# Altium project SUBBOARD-MCU.PrjPcb
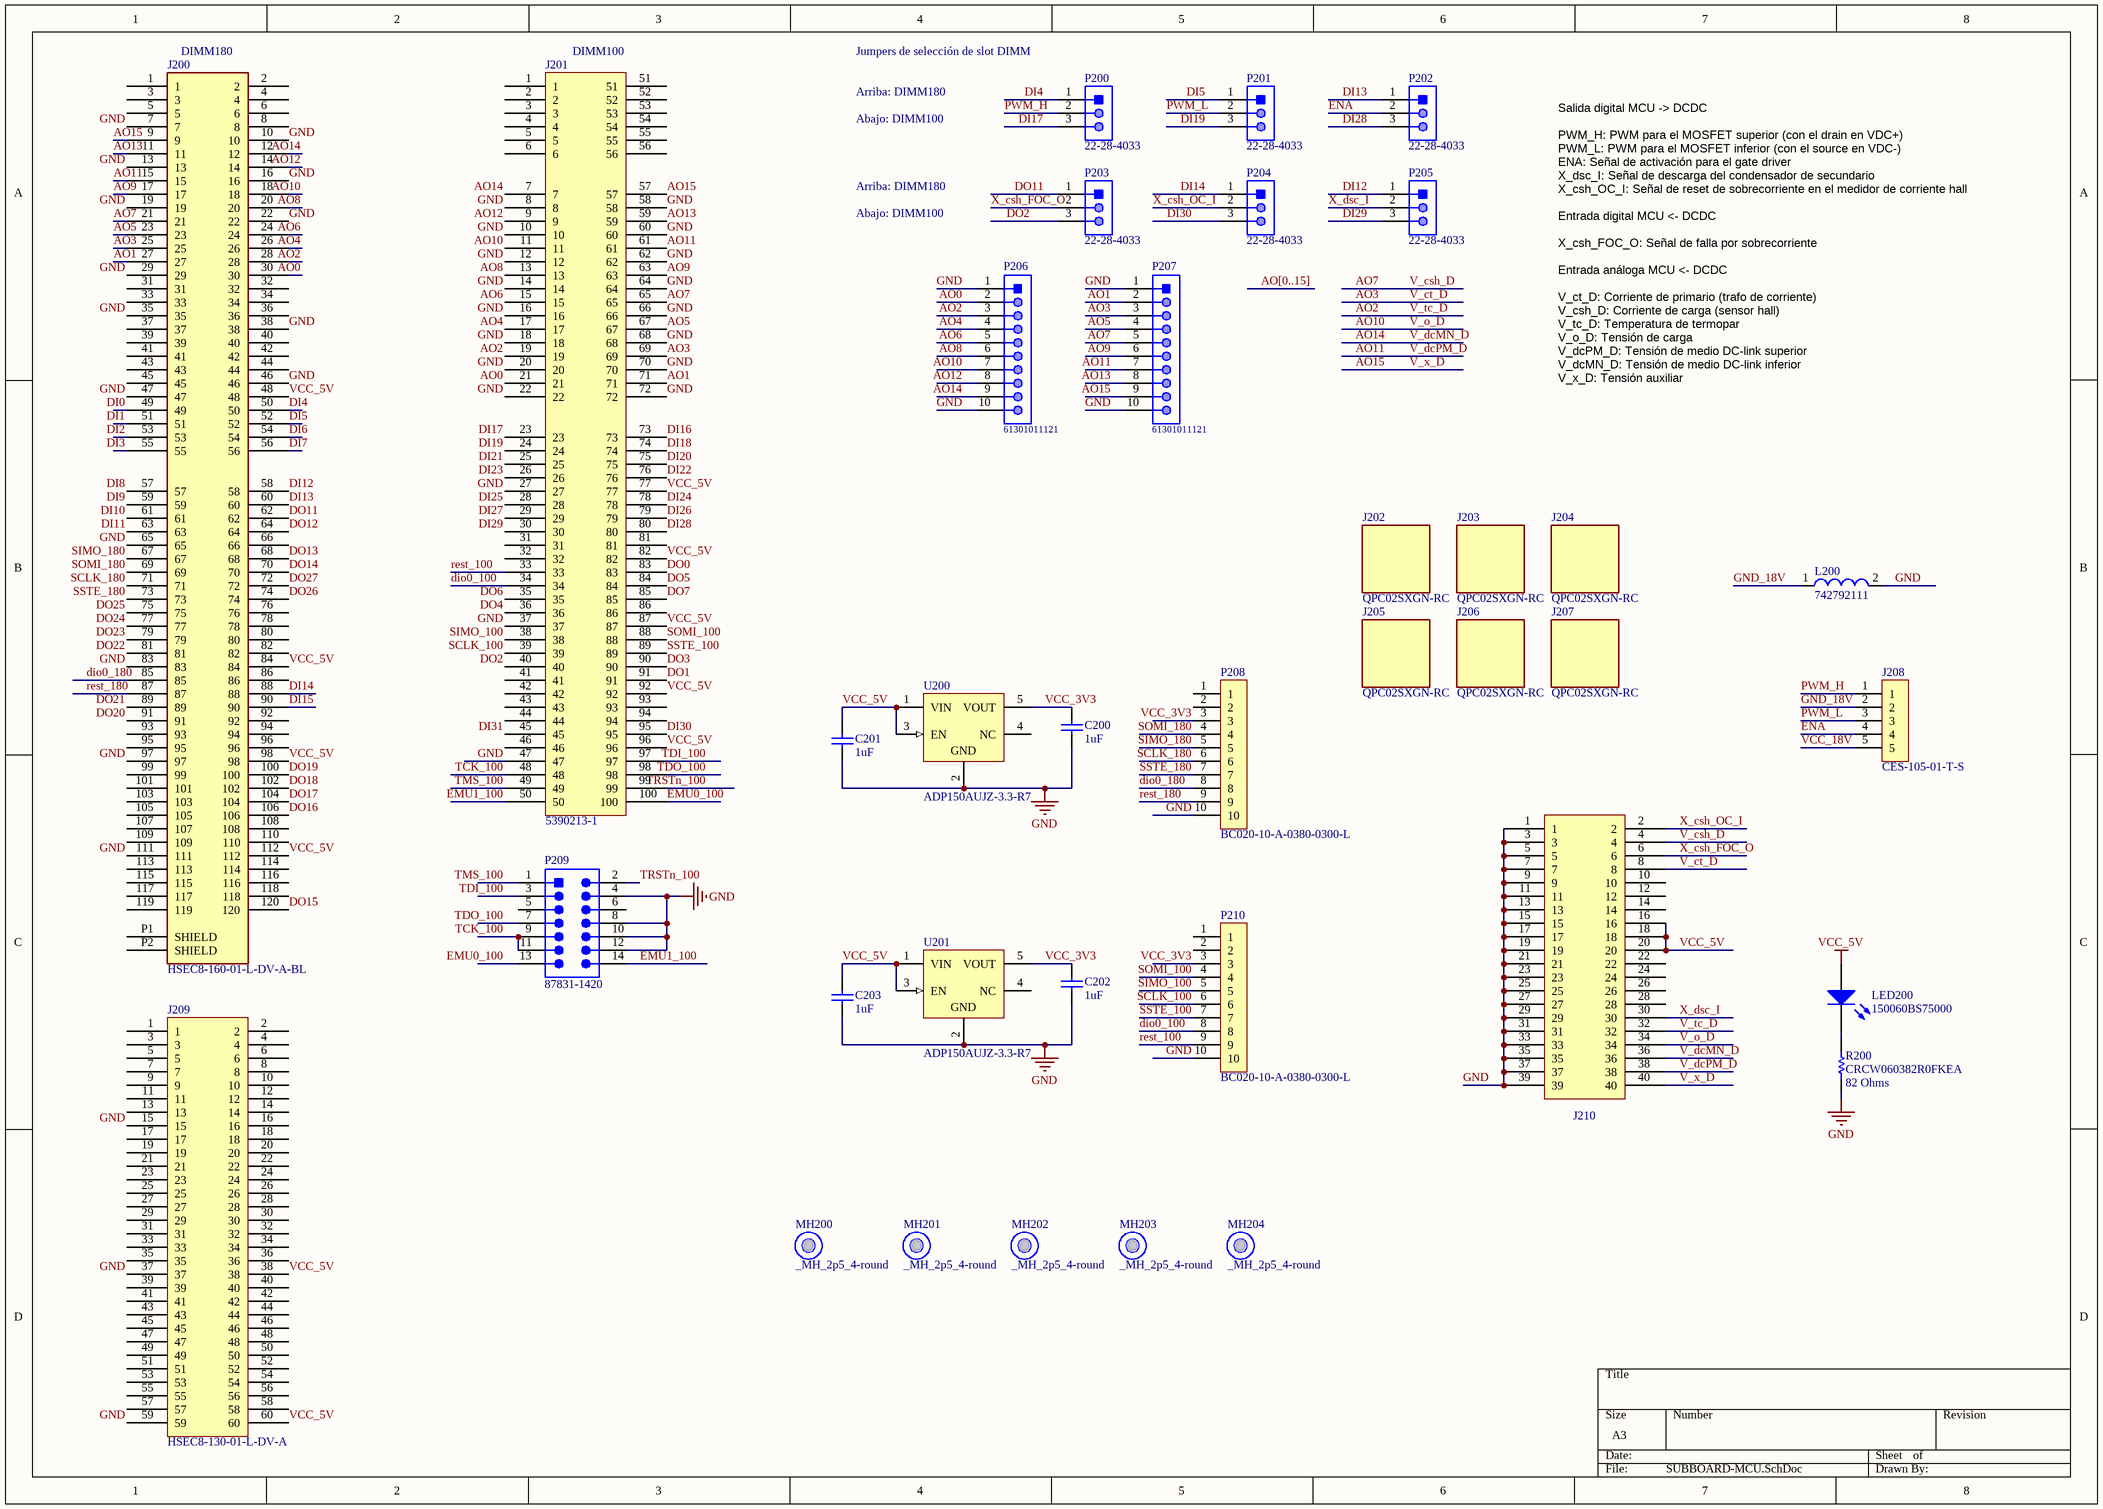
[diagram p0: SUBBOARD-MCU.SchDoc]
1 sheet, 36 parts. Net scope: global (net labels, ports and power ports of the same name join across sheets).
Board file: SUBBOARD-MCU.PcbDoc

## Sheet SUBBOARD-MCU.SchDoc
size A3

### Parts
C200  value 1uF  [CAPC0603(1608)100_N]  (hidden comment: CAP 1uF 50V 0603(1608))
C201  value 1uF  [CAPC0603(1608)100_N]  (hidden comment: CAP 1uF 50V 0603(1608))
C202  value 1uF  [CAPC0603(1608)100_N]  (hidden comment: CAP 1uF 50V 0603(1608))
C203  value 1uF  [CAPC0603(1608)100_N]  (hidden comment: CAP 1uF 50V 0603(1608))
J200  HSEC8-160-01-L-DV-A-BL  [HSEC8-160-01-L-DV-A-BL]
J201  5390213-1  [TE_5390213-1]
J202  QPC02SXGN-RC  [FP-QPC02SXGN-RC-MFG]
J203  QPC02SXGN-RC  [FP-QPC02SXGN-RC-MFG]
J204  QPC02SXGN-RC  [FP-QPC02SXGN-RC-MFG]
J205  QPC02SXGN-RC  [FP-QPC02SXGN-RC-MFG]
J206  QPC02SXGN-RC  [FP-QPC02SXGN-RC-MFG]
J207  QPC02SXGN-RC  [FP-QPC02SXGN-RC-MFG]
J208  CES-105-01-T-S  [CES-105-01-T-S]
J209  HSEC8-130-01-L-DV-A  [HSEC8-130-01-L-DV-A]
J210  CLP-120-02-F-DH  [CLP-120-02-F-DH]  (value not drawn)
L200  742792111  [SMD-1206]
LED200  150060BS75000  [0603_A]
MH200  _MH_2p5_4-round  [_MH_2p5_4-round]
MH201  _MH_2p5_4-round  [_MH_2p5_4-round]
MH202  _MH_2p5_4-round  [_MH_2p5_4-round]
MH203  _MH_2p5_4-round  [_MH_2p5_4-round]
MH204  _MH_2p5_4-round  [_MH_2p5_4-round]
P200  22-28-4033  [MOLX-22-28-4033_V]
P201  22-28-4033  [MOLX-22-28-4033_V]
P202  22-28-4033  [MOLX-22-28-4033_V]
P203  22-28-4033  [MOLX-22-28-4033_V]
P204  22-28-4033  [MOLX-22-28-4033_V]
P205  22-28-4033  [MOLX-22-28-4033_V]
P206  61301011121  [61301011121]
P207  61301011121  [61301011121]
P208  BC020-10-A-0380-0300-L  [BC020-10-A-0380-0300-L]
P209  87831-1420  [MOLEX-87831-1420_V]
P210  BC020-10-A-0380-0300-L  [BC020-10-A-0380-0300-L]
R200  CRCW060382R0FKEA  value 82 Ohms  [RESC1609X50X30LL10T20]
U200  ADP150AUJZ-3.3-R7  [ADI-UJ-5_M]
U201  ADP150AUJZ-3.3-R7  [ADI-UJ-5_M]

### Nets
GND: C200.1 C201.1 C202.1 C203.1 J200.7 J200.10 J200.13 J200.16 J200.19 J200.22 J200.29 J200.35 J200.38 J200.46 J200.47 J200.65 J200.83 J200.97 J200.111 J201.8 J201.10 J201.12 J201.14 J201.16 J201.18 J201.20 J201.22 J201.27 J201.37 J201.47 J201.58 J201.60 J201.62 J201.64 J201.66 J201.68 J201.70 J201.72 J209.15 J209.37 J209.59 J210.1 J210.3 J210.5 J210.7 J210.9 J210.11 J210.13 J210.15 J210.17 J210.19 J210.21 J210.23 J210.25 J210.27 J210.29 J210.31 J210.33 J210.35 J210.37 J210.39 L200.2 P206.1 P206.10 P207.1 P207.10 P208.10 P209.4 P209.8 P209.10 P209.12 P210.10 R200.2 U200.2(GND) U201.2(GND)
VCC_5V: C201.2 C203.2 J200.48 J200.84 J200.98 J200.112 J201.77 J201.82 J201.87 J201.92 J201.96 J209.38 J209.60 J210.16 J210.18 J210.20 LED200.2(A) U200.1(VIN) U200.3(EN) U201.1(VIN) U201.3(EN)
AO0: J200.30 J201.21 P206.2
AO1: J200.27 J201.71 P207.2
AO2: J200.28 J201.19 J210.32 P206.3  [also labelled V_tc_D]
AO3: J200.25 J201.69 J210.8 P207.3  [also labelled V_ct_D]
AO4: J200.26 J201.17 P206.4
AO5: J200.23 J201.67 P207.4
AO6: J200.24 J201.15 P206.5
AO7: J200.21 J201.65 J210.4 P207.5  [also labelled V_csh_D]
AO8: J200.20 J201.13 P206.6
AO9: J200.17 J201.63 P207.6
AO10: J200.18 J201.11 J210.34 P206.7  [also labelled V_o_D]
AO11: J200.15 J201.61 J210.38 P207.7  [also labelled V_dcPM_D]
AO12: J200.14 J201.9 P206.8
AO13: J200.11 J201.59 P207.8
AO14: J200.12 J201.7 J210.36 P206.9  [also labelled V_dcMN_D]
AO15: J200.9 J201.57 J210.40 P207.9  [also labelled V_x_D]
DI0: J200.49
DI1: J200.51
DI2: J200.53
DI3: J200.55
DI4: J200.50 P200.1
DI5: J200.52 P201.1
DI6: J200.54
DI7: J200.56
DI8: J200.57
DI9: J200.59
DI10: J200.61
DI11: J200.63
DI12: J200.58 P205.1
DI13: J200.60 P202.1
DI14: J200.88 P204.1
DI15: J200.90
DI16: J201.73
DI17: J201.23 P200.3
DI18: J201.74
DI19: J201.24 P201.3
DI20: J201.75
DI21: J201.25
DI22: J201.76
DI23: J201.26
DI24: J201.78
DI25: J201.28
DI26: J201.79
DI27: J201.29
DI28: J201.80 P202.3
DI29: J201.30 P205.3
DI30: J201.95 P204.3
DI31: J201.45
dio0_100: J201.34 P210.8
dio0_180: J200.85 P208.8
DO0: J201.83
DO1: J201.91
DO2: J201.40 P203.3
DO3: J201.90
DO4: J201.36
DO5: J201.84
DO6: J201.35
DO7: J201.85
DO11: J200.62 P203.1
DO12: J200.64
DO13: J200.68
DO14: J200.70
DO15: J200.120
DO16: J200.106
DO17: J200.104
DO18: J200.102
DO19: J200.100
DO20: J200.91
DO21: J200.89
DO22: J200.81
DO23: J200.79
DO24: J200.77
DO25: J200.75
DO26: J200.74
DO27: J200.72
EMU0_100: J201.100 P209.13
EMU1_100: J201.50 P209.14
ENA: J208.4 P202.2
GND_18V: J208.2 L200.1
PWM_H: J208.1 P200.2
PWM_L: J208.3 P201.2
rest_100: J201.33 P210.9
rest_180: J200.87 P208.9
SCLK_100: J201.39 P210.6
SCLK_180: J200.71 P208.6
SIMO_100: J201.38 P210.5
SIMO_180: J200.67 P208.5
SOMI_100: J201.88 P210.4
SOMI_180: J200.69 P208.4
SSTE_100: J201.89 P210.7
SSTE_180: J200.73 P208.7
TCK_100: J201.48 P209.9 P209.11
TDI_100: J201.97 P209.3
TDO_100: J201.98 P209.7
TMS_100: J201.49 P209.1
TRSTn_100: J201.99 P209.2
VCC_3V3: C200.2 C202.2 P208.3 P210.3 U200.5(VOUT) U201.5(VOUT)
VCC_18V: J208.5
X_csh_FOC_O: J210.6 P203.2
X_csh_OC_I: J210.2 P204.2
X_dsc_I: J210.30 P205.2
NetLED200_1: LED200.1(K) R200.1

Not connected (* = marked no-connect by the designer): J200 1 2 3 4 5 6 8 31 32 33 34 36 37 39 40 41 42 43 44 45 66 76 78 80 82 86 92 93 94 95 96 99 101 103 105 107 108 109 110 113 114 115 116 117 118 119 P1(SHIELD) P2(SHIELD); J201 1 2 3 4 5 6 31 32 41 42 43 44 46 51 52 53 54 55 56 81 86 93 94; J209 1 2 3 4 5 6 7 8 9 10 11 12 13 14 16 17 18 19 20 21 22 23 24 25 26 27 28 29 30 31 32 33 34 35 36 39 40 41 42 43 44 45 46 47 48 49 50 51 52 53 54 55 56 57 58; J210 10 12 14 22 24 26 28; P208 1 2; P209 5 6; P210 1 2; U200 4(NC); U201 4(NC)

### Buses and harness runs
bus AO[0..15]

### Notes on the sheet
- (near J200) DIMM180
- (near J201) DIMM100
- Arriba: DIMM180
- (near P200) Jumpers de selección de slot DIMM
- Abajo: DIMM100
- Salida digital MCU -> DCDC
  PWM_H: PWM para el MOSFET superior (con el drain en VDC+)
  PWM_L: PWM para el MOSFET inferior (con el source en VDC-)
  ENA: Señal de activación para el gate driver
  X_dsc_I: Señal de descarga del condensador de secundario
  X_csh_OC_I: Señal de reset de sobrecorriente en el medidor de corriente hall
  Entrada digital MCU <- DCDC
  X_csh_FOC_O: Señal de falla por sobrecorriente
  Entrada análoga MCU <- DCDC
  V_ct_D: Corriente de primario (trafo de corriente)
  V_csh_D: Corriente de carga (sensor hall)
  V_tc_D: Temperatura de termopar
  V_o_D: Tensión de carga
  V_dcPM_D: Tensión de medio DC-link superior
  V_dcMN_D: Tensión de medio DC-link inferior
  V_x_D: Tensión auxiliar

### Library data of the parts
C200-C203 = CMP-1035-02746-1: CAP 1uF 50V ±20% 0603 (1608 Metric) Thickness 1mm SMD; Tolerance: Â±20%; Case-EIA: 0603; Case-Metric: 1608; Technology: SMT; Max Thickness: 1 mm; Rated Voltage: 50 V
J200 = HSEC8-160-01-L-DV-A-BL: Standard Card Edge Connectors 0.80 mm Edge Rate High-Speed Edge Card Connector, Vertical; Manufacturer: Samtec; Number of Contacts: 120; Pitch: 0.8mm; Manufacturer Part Number: HSEC8-160-01-L-DV-A-BL; RoHS: Yes; Category: Card Edge Connectors; Stock 1: 1044; Pricing 1: 1=8,23000, 10=7,88900, 25=7,20320, 50=6,86000, 100=6,51700, 250=5,83100, 500=5,48800, 1000=4,80200, 2500=4,56190 (USD); Mount: Surface Mount; Contact Plating: Gold; Number of Rows: 2; Packaging: Bulk; Termination: Solder; Radiation Hardening: No; ComponentLink1URL: http://www.farnell.com/datasheets/2260788.pdf?src-supplier=Farnell; ComponentLink1Description: http://www.farnell.com/datasheets/2260788.pdf?src-supplier=Farnell; ComponentLink2URL: http://www.farnell.com/datasheets/2581211.pdf?src-supplier=Farnell; ComponentLink2Description: http://www.farnell.com/datasheets/2581211.pdf?src-supplier=Farnell; ComponentLink3URL: http://suddendocs.samtec.com/catalog_english/hsec8_dv.pdf?src-supplier=Digi-Key; ComponentLink3Description: http://suddendocs.samtec.com/catalog_english/hsec8_dv.pdf?src-supplier=Digi-Key; ComponentLink4URL: http://www.samtec.com/ftppub/pdf/HSEC8_DV.pdf?src-supplier=Avnet; ComponentLink4Description: http://www.samtec.com/ftppub/pdf/HSEC8_DV.pdf?src-supplier=Avnet; ComponentLink5URL: http://www.farnell.com/datasheets/2581211.pdf?src-supplier=Element14; ComponentLink5Description: http://www.farnell.com/datasheets/2581211.pdf?src-supplier=Element14; ComponentLink6URL: http://www.farnell.com/datasheets/2581211.pdf?src-supplier=Newark; ComponentLink6Description: http://www.farnell.com/datasheets/2581211.pdf?src-supplier=Newark; Supplier 1: Digi-Key; Supplier 2: Arrow; Supplier 3: Mouser; Supplier Part Number 1: SAM9083-ND; Supplier Part Number 2: HSEC8-160-01-L-DV-A-BL; Supplier Part Number 3: 200-HSEC816001LDVABL
J201 = 5390213-1: 100 Position DIMM DRAM Socket Through Hole; Centerline_Pitch: 1.27 mm[.05 in]; MF: TE Connectivity; Number_of_Positions: 100; SnapEDA_Link: https://www.snapeda.com/parts/5390213-1/TE%20Connectivity%20AMP%20Connectors/view-part/781316/?ref=snap; MP: 5390213-1; TE_purchase_URL: https://www.te.com/usa-en/product-5390213-1.html?te_bu=Cor&te_type=disp&te_campaign=seda_glo_cor-seda-global-disp-prtnr-fy19-seda-model-bom-cta_sma-317_1&elqCampaignId=32493; Availability: Unavailable; EU_RoHS_Compliance: Compliant; Price: None; Product_Type: Socket; Package: None; Value: *; Supplier 1: Newark; Supplier 2: Digi-Key; Supplier 3: Mouser; Supplier Part Number 1: 42K7163; Supplier Part Number 2: A121375-ND; Supplier Part Number 3: 571-5390213-1
J202-J207 = CMP-25666-000001-1: CONN JUMPER SHORTING .100" GOLD; Manufacturer: Sullins; Conn Orientation: Straight; Pitch: 2.54mm; Current Rating: 3A; Number Of Contacts: 2; Category: Conn; Temperature Range Low: -40°C; Temperature Range High: +85°C; Device Class L1: Connectors; Lead Free: Yes; Manufacturer Part Number: QPC02SXGN-RC; Automotive: No; Height: 6.17mm; ComponentLink2URL: https://s3.amazonaws.com/catalogspreads-pdf/PAGE128-129%20.100%20JUMPER.pdf; Device Class L2: unset; Footprint Url: https://drawings-pdf.s3.amazonaws.com/11510.pdf; Device Class L3: unset; Temperature: -40°C to +85°C; RoHS: TRUE; Digikey Description: CONN JUMPER SHORTING .100" GOLD; Octopart: https://octopart.com/qpc02sxgn-rc-sullins-19878795; Package: 0; ComponentLink2Description: Datasheet; Contact Material: Gold
J208 = CES-105-01-T-S: SAMTEC         CES-105-01-T-S             Board-To-Board Connector, CES Series, 5 Contacts, Receptacle, 2.54 mm, Through Hole, 1 Rows; Number of Contacts: 5; Contact Resistance: 10mR; Max Current Rating: 1A; Max Voltage Rating (AC): 400V; Pitch: 2.54mm; Manufacturer: Samtec; Manufacturer Part Number: CES-105-01-T-S; RoHS: Yes; Category: Connectors; Stock 1: 235; Pricing 1: 1=0,57000, 10=0,53600, 25=0,48280, 50=0,42920, 100=0,41120, 250=0,37548, 500=0,35760 (USD); Mount: Through Hole; Contact Plating: Tin; Housing Color: Black; Contact Material: Bronze; Color: Black; Housing Material: Polyester; Min Operating Temperature: -55°C; Max Operating Temperature: 105°C; Number of Rows: 1; Termination: Solder; Orientation: Straight; Packaging: Bulk; Package Quantity: 1; Connector Type: Receptacle; Number of Positions: 5; Gender: Receptacle; Length: 12.7mm; Depth: 3.05mm; Width: 3.05mm; Radiation Hardening: No; Lead Free: Lead Free; REACH SVHC: No SVHC; ComponentLink1URL: https://datasheet.ciiva.com/413/ces-mkt-413356.pdf?src-supplier=Digi-Key; ComponentLink1Description: https://datasheet.ciiva.com/413/ces-mkt-413356.pdf?src-supplier=Digi-Key; Supplier 1: Digi-Key; Supplier 2: Arrow; Supplier 3: Mouser; Supplier 4: Newark; Supplier Part Number 2: CES-105-01-T-S; Supplier Part Number 3: 200-CES10501TS; Supplier Part Number 4: 11P3506; Supplier Part Number 1: SAM1087-05-ND
J209 = HSEC8-130-01-L-DV-A: Standard Card Edge Connectors 0.80 mm Edge Rate High-Speed Edge Card Connector, Vertical; Manufacturer: Samtec; Number of Contacts: 60; Gender: Female; Current Rating: 3.1A; Pitch: 0.8mm; Manufacturer Part Number: HSEC8-130-01-L-DV-A; RoHS: Yes; Category: Card Edge Connectors; Stock 1: 491; Pricing 1: 1=4,35000, 10=4,17600, 25=3,82800, 50=3,65400, 100=3,48000, 250=3,04500, 500=2,95800, 1000=2,52300, 2500=2,34900 (USD); Mount: Surface Mount; Contact Plating: Gold; Contact Material: Copper; Housing Color: Black; Housing Material: Polymer; Min Operating Temperature: -55°C; Max Operating Temperature: 125°C; Termination: Solder; Number of Rows: 2; Packaging: Bulk; Orientation: Straight; Length: 28.6mm; Depth: 7.8mm; Width: 5.6mm; Radiation Hardening: No; ComponentLink1URL: https://datasheet.ciiva.com/25615/0900766b8114ca7f-25615848.pdf?src-supplier=RSComponents; ComponentLink1Description: https://datasheet.ciiva.com/25615/0900766b8114ca7f-25615848.pdf?src-supplier=RSComponents; ComponentLink2URL: https://datasheet.ciiva.com/16666/hsec8-dv-16666379.pdf?src-supplier=Avnet+Europe; ComponentLink2Description: https://datasheet.ciiva.com/16666/hsec8-dv-16666379.pdf?src-supplier=Avnet+Europe; Supplier 1: Digi-Key; Supplier 2: Mouser; Supplier 3: Farnell; Supplier 4: Newark; Supplier Part Number 4: 43W4470; Supplier Part Number 3: 3103224; Supplier Part Number 2: 200-HSEC813001LDVA; Supplier Part Number 1: SAM9080-ND
J210 = CLP-120-02-F-DH: SAMTEC         CLP-120-02-F-DH             Board-To-Board Connector, Vertical, CLP Series, 40 Contacts, Receptacle, 1.27 mm, Surface Mount; Number of Contacts: 40; Pitch: 1.27mm; Supplier 1: Mouser; Manufacturer: Samtec; Manufacturer Part Number: CLP-120-02-F-DH; RoHS: Yes; Category: Headers and Wire Housings; Stock 1: 30; Pricing 1: 1=6.74000, 10=5.62000, 100=4.78000, 250=4.26000, 500=3.93000, 1000=3.68000 (USD); Mount: Surface Mount; Contact Plating: Gold; Contact Material: Bronze; Termination: Solder; Number of Rows: 2; Gender: Receptacle; Lead Free: Lead Free; REACH SVHC: No SVHC; ComponentLink1URL: http://www.farnell.com/datasheets/1902564.pdf?src-supplier=Farnell; ComponentLink1Description: http://www.farnell.com/datasheets/1902564.pdf?src-supplier=Farnell; ComponentLink2URL: http://cloud.samtec.com/catalog_english/clp_sm.pdf?src-supplier=Avnet; ComponentLink2Description: http://cloud.samtec.com/catalog_english/clp_sm.pdf?src-supplier=Avnet; Supplier Part Number 1: 200-CLP12002FDH; Supplier 2: Digi-Key; Pricing 2: 1=6.46000 (USD); Supplier Part Number 2: CLP-120-02-F-DH-ND; System: Connector
L200 = CMP-0220-00024-1: SMD EMI Suppression Ferrite Bead WE-CBF, Z = 26 Ohm; Impedance: 26 Ohm; ComponentLink2Description: Datasheet; PackageReference: SMD-1206; ComponentLink2URL: http://www.we-online.de/katalog/media/pdf/742792111.pdf; PackageVersion: 2007; DatasheetVersion: Dec-2005; PackageDescription: Chip Inductor, 2-Leads, Body 3.2 x 1.6 mm; ComponentLink1URL: http://www.we-online.com; ComponentLink1Description: Manufacturer Link
LED200 = CMP-1426-00003-1: SMD mono-color Chip LED, WL-SMCW, Blue; Manufacturer: Wuerth Elektronik; Color: Blue; ComponentLink2Description: Datasheet; ComponentLink2URL: http://katalog.we-online.com/led/datasheet/150060BS75000.pdf; ComponentLink1URL: http://www.we-online.com; PackageReference: 0603_A; PartNumber: 150060BS75000; ComponentLink1Description: Manufacturer URL
MH200-MH204 = _MH_2p5_4-round: matching hole 2.5 hole, 4mm pad (round)
P200-P205 = CMP-1676-00001-5: Male Header, Pitch 2.54 mm, 1 x 3 Position, Height 8.38 mm, Tail Length 3.18 mm, RoHS, Bulk; Manufacturer: Molex; Rows: 1; Voltage Rating: 250 V; Current Rating: 4 A; Min Operating Temperature: 0 degC; Lead Pitch: 0.1 inch; Packaging: Bulk; Contact Finish: Gold; RoHSCompliant: true; Contact Material: Brass; PackageReference: 22-28-4033; REACH SVHC: Unknown; PackageDescription: Male Header, Pitch 2.54 mm, 1 x 3 Position, Height 8.38 mm, Tail Length 3.18 mm; ComponentLink2URL: http://www.molex.com/pdm_docs/sd/022284033_sd.pdf; Height: 8.38 mm; Mounting Technology: Through Hole; ComponentLink1Description: Manufacturer URL; Length: 7.62 mm; Mount: Through Hole; DatasheetVersion: Rev. G, 01/2012; Max Operating Temperature: 75 degC; ComponentLink2Description: Datasheet; Colour: Black; Pins: 3; Contact Plating: Gold; Package Quantity: 1; ComponentLink1URL: http://www.molex.com/
P206 P207 = CMP-1502-01082-1: THT Vertical Pin Header WR-PHD, Pitch 2.54 mm, Single Row, 10 pins; Manufacturer: Wurth Elektronik; Contact Resistance: 20mOhm; Rated Current: 3A; Pitch: 2.54mm; Gender: Male; Pin Number: 10; Working Voltage: 250VAC; Withstanding Voltage: 500VAC; Manufacturer URL: http://www.we-online.de; Operating Temperature: -40to105degC; Datasheet URL: https://katalog.we-online.de/em/datasheet/6130xx11121.pdf; Row Number: Single; Orientation: Vertical; Part Number: 61301011121; Packaging: Bag; Package Reference: 61301011121; Mounting Technology: THT; Publisher: WurthElektronik
P208 P210 = BC020-10-A-0380-0300-L: BOARD-BOARD CONNECTOR, HEADER, 10WAY, 1ROW; Product Range:BC020 Series; Contact Termination Type:Through Hole; Gender:Header; No. of Contacts:10; Pitch Spacing:1mm; Contact Plating:Gold Plated Contacts; Contact Material:Copper Alloy ;RoHS Compliant: Yes; Manufacturer: Global Connector Technology; Gender: Male; Number of Contacts: 10; Manufacturer Part Number: BC020-10-A-0380-0300-L; RoHS: Yes; Category: Connectors; Stock 1: 1113; Pricing 1: 1=0,66300, 10=0,66300, 25=0,66300, 50=0,66300, 100=0,66300, 250=0,66300, 500=0,66300, 1000=0,66300 (USD); Mount: Through Hole; Contact Plating: Gold; Contact Material: Copper Alloy; Termination: Through Hole; Number of Rows: 1; REACH SVHC: No SVHC; ComponentLink1URL: http://www.farnell.com/datasheets/2342914.pdf?src-supplier=Farnell; ComponentLink1Description: http://www.farnell.com/datasheets/2342914.pdf?src-supplier=Farnell; ComponentLink2URL: http://www.farnell.com/datasheets/682675.pdf?src-supplier=Farnell; ComponentLink2Description: http://www.farnell.com/datasheets/682675.pdf?src-supplier=Farnell; ComponentLink3URL: http://www.farnell.com/datasheets/682675.pdf?src-supplier=Element14; ComponentLink3Description: http://www.farnell.com/datasheets/682675.pdf?src-supplier=Element14; Supplier 1: Newark; Supplier 2: Farnell; Supplier 3: Newark; Supplier Part Number 1: 67R6873; Supplier Part Number 2: 2577320; Supplier Part Number 3: 42AC9863; System: Connector
P209 = CMP-2000-05240-1: Header, Pitch 2 mm, 2 x 7 Position, Height 6.4 mm, Tail Length 2.5 mm, -55 to 105 degC, RoHS, Tube; Number of Positions / Contacts: 14; Current Rating: 2A; Brand: Molex; Mounting Angle: Vertical; Pitch: 2mm; Voltage Rating: 125V; Datasheet Version: Rev. E, 04/2006; Housing Material: Thermoplastic; Contact Material: Brass; Datasheet URL: https://datasheet.ciiva.com/27096/1934585-27096088.pdf; Type: Shrouded; Number of Positions: 14; Mounting Style: ThroughHole; Product Category: Headers&WireHousings; RoHS: Details; Factory Pack Quantity: 3200; Contact Plating: Gold; Series: 87831; Number of Rows: 2; Manufacturer: Molex; Product Type: Headers; Termination Style: ThroughHole; Packaging: Tube; Tradename: Milli-Grid; Manufacturer URL: http://www.molex.com/
R200 = CMP-2000-03606-1: Manufacturer: Vishay Dale; Part Number: CRCW060382R0FKEA
U200 U201 = CMP-0786-00394-1: Ultralow Noise, 150 mA CMOS Linear Regulator, 2.2 to 5.5 V Vin, 3.3 V Vout, Industrial, 5-pin SOT23 (UJ-5), Reel; Manufacturer: Analog Devices; Supply Current IGND @ Small Load: 10uA; Vin (min) (V): 2.2; Iout max: 150mA; Preset Vout Values (V): 3.3; Vin (max) (V): 5.5; ComponentLink2Description: Datasheet; PackageReference: UJ-5; DatasheetVersion: Rev. A; PackageDescription: 5-Pin Thin Small Outline Transistor Package, Body 2.9 x 1.6 mm, Pitch 0.95 mm; ComponentLink4URL: Product URL:http://www.analog.com/en/ADP150/productSearch.html; Packing: Reel; ComponentLink1URL: http://www.analog.com/en/index.html; PartNumber: ADP150AUJZ-3.3-R7; PackageVersion: 100708-A, 10/2008; ComponentLink3Description: Package Specification; ComponentLink3URL: http:/www.analog.com/static/imported-files/packages/PKG_PDF/TSOT(UJ)/UJ_5.pdf; ComponentLink4Description: URL Link1; ComponentLink2URL: http://www.analog.com/static/imported-files/data_sheets/ADP150.pdf; Code_JEDEC: MO-193-AB; Mounting Technology: Surface Mount; ComponentLink1Description: Manufacturer URL